# Altium schematic sheet recv_board.SchDoc
size A3; SheetNumber: 5; SheetTotal: 5
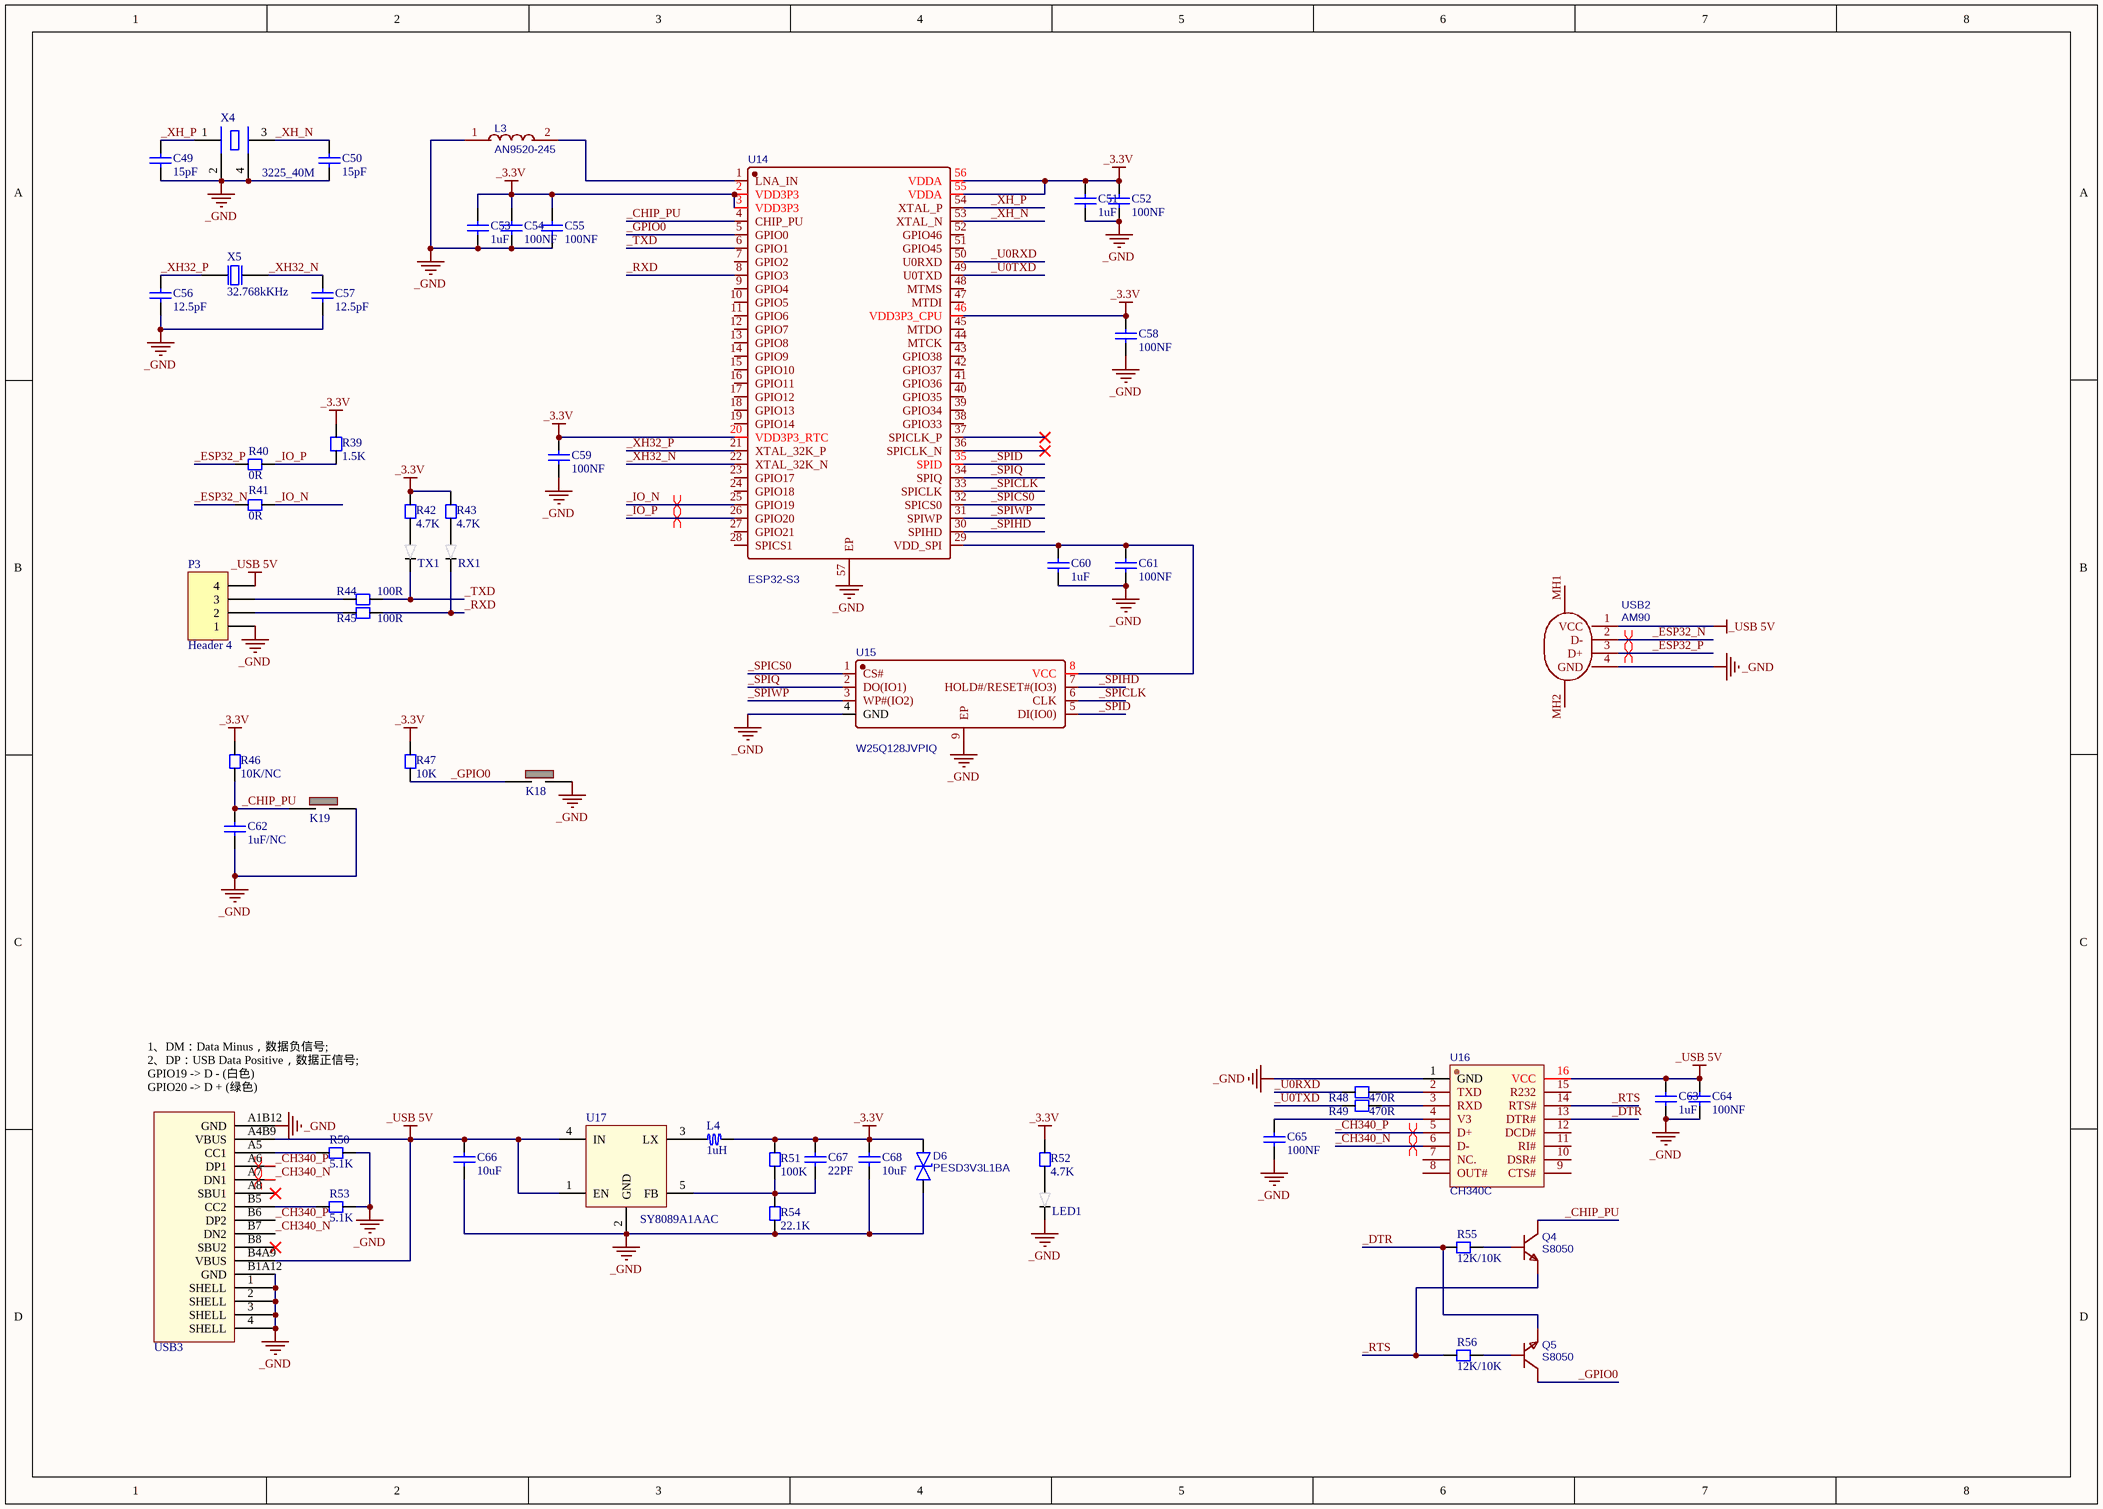
[diagram p0: recv_board.SchDoc]

## Parts
C49  15pF  [CC1608-0603]
C50  15pF  [CC1608-0603]
C51  1uF  [CC1608-0603]
C52  100NF  [CC1608-0603]
C53  1uF  [CC1608-0603]
C54  100NF  [CC1608-0603]
C55  100NF  [CC1608-0603]
C56  12.5pF  [CC1608-0603]
C57  12.5pF  [CC1608-0603]
C58  100NF  [CC1608-0603]
C59  100NF  [CC1608-0603]
C60  1uF  [CC1608-0603]
C61  100NF  [CC1608-0603]
C62  1uF/NC  [CC1608-0603]
C63  1uF  [CC1608-0603]
C64  100NF  [CC1608-0603]
C65  100NF  [CC1608-0603]
C66  10uF  [CC1608-0603]
C67  22PF  [CC1608-0603]
C68  10uF  [CC1608-0603]
D6  PESD3V3L1BA  [SOD-323]
K18  KEY 3*4  [KEY 3*4]  (value not drawn)
K19  KEY 3*4  [KEY 3*4]  (value not drawn)
L3  AN9520-245  [ANT-SMD_L9.5-W2.1]
L4  1uH  [Inductor-4018]
LED1  LED 0603  [LED 0603]  (value not drawn)
P3  Header 4  [HDR1X4]
Q4  S8050  [SOT-23]
Q5  S8050  [SOT-23]
R39  1.5K  [CR1608-0603]
R40  0R  [CR1608-0603]
R41  0R  [CR1608-0603]
R42  4.7K  [CR1608-0603]
R43  4.7K  [CR1608-0603]
R44  100R  [CR1608-0603]
R45  100R  [CR1608-0603]
R46  10K/NC  [CR1608-0603]
R47  10K  [CR1608-0603]
R48  470R  [CR1608-0603]
R49  470R  [CR1608-0603]
R50  5.1K  [CR1608-0603]
R51  100K  [CR1608-0603]
R52  4.7K  [CR1608-0603]
R53  5.1K  [CR1608-0603]
R54  22.1K  [CR1608-0603]
R55  12K/10K  [CR1608-0603]
R56  12K/10K  [CR1608-0603]
RX1  LED 0603  [LED 0603]  (value not drawn)
TX1  LED 0603  [LED 0603]  (value not drawn)
U14  ESP32-S3  [QFN-56]
U15  W25Q128JVPIQ  [WSON-8]
U16  CH340C  [SOP-16]
U17  SY8089A1AAC  [SOT23-5]
USB2  AM90  [USB-AM]
USB3  Tpye-c 16P  [TYPE-C 16P]  (value not drawn)
X4  3225_40M  [XTAL-3225]
X5  32.768kKHz  [XTAL-3215]

## Nets
_3.3V: C51.2 C52.2 C53.2 C54.2 C55.2 C58.2 C59.2 C67.2 C68.2 D6.1 L4.2 R39.1 R42.1 R43.1 R46.2 R47.2 R51.1 R52.1 U14.2(VDD3P3) U14.3(VDD3P3) U14.20(VDD3P3_RTC) U14.46(VDD3P3_CPU) U14.55(VDDA) U14.56(VDDA)
_GND: C49.1 C50.1 C51.1 C52.1 C53.1 C54.1 C55.1 C56.1 C57.1 C58.1 C59.1 C60.1 C61.1 C62.1 C63.1 C64.1 C65.1 C66.1 C68.1 D6.2 K18.2 K19.2 L3.1 LED1.2 P3.1 R50.1 R53.1 R54.2 U14.57(EP) U15.4(GND) U15.9(EP) U16.1(GND) U17.2(GND) USB2.4(GND) USB3.1(SHELL) USB3.2(SHELL) USB3.3(SHELL) USB3.4(SHELL) USB3.A1B12(GND) USB3.B1A12(GND) X4.2(GND) X4.4(GND)
_USB 5V: C63.2 C64.2 C66.2 P3.4 U16.16(VCC) U17.1(EN) U17.4(IN) USB2.1(VCC) USB3.A4B9(VBUS) USB3.B4A9(VBUS)
_CH340_N: U16.6(D-) USB3.A7(DN1) USB3.B7(DN2)
_CH340_P: U16.5(D+) USB3.A6(DP1) USB3.B6(DP2)
_CHIP_PU: C62.2 K19.1 Q4.3(C) R46.1 U14.4(CHIP_PU)
_DTR: Q5.2(E) R55.1 U16.13(DTR#)
_ESP32_N: R41.2 USB2.2(D-)
_ESP32_P: R40.2 USB2.3(D+)
_GPIO0: K18.1 Q5.3(C) R47.1 U14.5(GPIO0)
_IO_N: R41.1 U14.25(GPIO19)
_IO_P: R39.2 R40.1 U14.26(GPIO20)
_RTS: Q4.2(E) R56.1 U16.14(RTS#)
_RXD: R45.1 RX1.2 U14.8(GPIO3)
_SPICLK: U14.33(SPICLK) U15.6(CLK)
_SPICS0: U14.32(SPICS0) U15.1(CS#)
_SPID: U14.35(SPID) U15.5(DI(IO0))
_SPIHD: U14.30(SPIHD) U15.7(HOLD#/RESET#(IO3))
_SPIQ: U14.34(SPIQ) U15.2(DO(IO1))
_SPIWP: U14.31(SPIWP) U15.3(WP#(IO2))
_TXD: R44.1 TX1.2 U14.6(GPIO1)
_U0RXD: R48.2 U14.50(U0RXD)
_U0TXD: R49.2 U14.49(U0TXD)
_XH32_N: C57.2 U14.22(XTAL_32K_N) X5.2(OSC2)
_XH32_P: C56.2 U14.21(XTAL_32K_P) X5.1(OSC1)
_XH_N: C50.2 U14.53(XTAL_N) X4.3(OSC2)
_XH_P: C49.2 U14.54(XTAL_P) X4.1(OSC1)
NetC60_2: C60.2 C61.2 U14.29(VDD_SPI) U15.8(VCC)
NetC65_2: C65.2 U16.4(V3)
NetC67_1: C67.1 R51.2 R54.1 U17.5(FB)
NetL3_2: L3.2 U14.1(LNA_IN)
NetL4_1: L4.1 U17.3(LX)
NetLED1_1: LED1.1 R52.2
NetP3_2: P3.2 R45.2
NetP3_3: P3.3 R44.2
NetQ4_1: Q4.1(B) R55.2
NetQ5_1: Q5.1(B) R56.2
NetR42_2: R42.2 TX1.1
NetR43_2: R43.2 RX1.1
NetR48_1: R48.1 U16.2(TXD)
NetR49_1: R49.1 U16.3(RXD)
NetR50_2: R50.2 USB3.A5(CC1)
NetR53_2: R53.2 USB3.B5(CC2)

Not connected (* = marked no-connect by the designer): U14 7(GPIO2) 9(GPIO4) 10(GPIO5) 11(GPIO6) 12(GPIO7) 13(GPIO8) 14(GPIO9) 15(GPIO10) 16(GPIO11) 17(GPIO12) 18(GPIO13) 19(GPIO14) 23(GPIO17) 24(GPIO18) 27(GPIO21) 28(SPICS1) 36(SPICLK_N)* 37(SPICLK_P)* 38(GPIO33) 39(GPIO34) 40(GPIO35) 41(GPIO36) 42(GPIO37) 43(GPIO38) 44(MTCK) 45(MTDO) 47(MTDI) 48(MTMS) 51(GPIO45) 52(GPIO46); U16 7(NC.) 8(OUT#) 9(CTS#) 10(DSR#) 11(RI#) 12(DCD#) 15(R232); USB2 MH1 MH2; USB3 A8(SBU1)* B8(SBU2)*

## Layout directives
differential pair: _CH340_N, _CH340_P, _ESP32_N, _ESP32_P, _IO_N, _IO_P

## Notes on the sheet
- (near USB3) 1、DM：Data Minus，数据负信号;
  2、DP：USB Data Positive，数据正信号;
  GPIO19 -> D - (白色)
  GPIO20 -> D + (绿色)

## Library data of the parts
C49-C68 = Cap Chip 0603: 0603封装的电容; Published: 8-Jun-2000; Revision: July-2002: Re-released for DXP Platform.; Publisher: Altium Limited
D6 = PESD3V3L1BA: SOD-323 3.3V 双向ESD防静电二极管保护芯片; Manufacturer: MDD; Manufacturer Part: SMAJ6.5CA; Supplier: LCSC; Supplier Part: C110041; JLCPCB Part Class: Extended Part; spicePre: D; spiceSymbolName: SMAJ6.5CA-C110041
K18 K19 = KEY 3*4: 轻触开关按键
L3 = AN9520-245: Manufacturer: rainsun(霖昱微); Supplier: LCSC; Manufacturer Part: AN9520-245; Supplier Part: C99665; JLCPCB Part Class: Extended Part; spicePre: L; spiceSymbolName: AN9520-245
L4 = Inductor-4018: 贴片电感 1206封装
P3 = Header 4: Header, 4-Pin; LatestRevisionDate: 17-Jul-2002; LatestRevisionNote: Re-released for DXP Platform.; Publisher: Altium Limited
Q4 Q5 = S8050: Manufacturer: SALLTECH(萨瑞); Contributor: lcsc; Supplier: LCSC; Supplier Part: C3027096; Manufacturer Part: S8050; spicePre: Q; spiceSymbolName: S8050_C3027096
R39-R56 = Resistor Chip 0603: 0603封装电阻; Published: 8-Jun-2000; Revision: July-2002: Re-released for DXP Platform.; Publisher: Altium Limited
U14 = ESP32-S3: Manufacturer: ESPRESSIF(乐鑫); Contributor: LCSC; Supplier: LCSC; Supplier Part: C2913192; Manufacturer Part: ESP32-S3; JLCPCB Part Class: Extended Part; spicePre: U; spiceSymbolName: ESP32-S3
U15 = W25Q128JVPIQ: Manufacturer: WINBOND(华邦); Contributor: LCSC; Supplier: LCSC; Supplier Part: C2803379; Manufacturer Part: W25Q128JVPIQ; JLCPCB Part Class: Extended Part; spicePre: U; spiceSymbolName: W25Q128JVPIQ
U16 = CH340C: Manufacturer: WCH(南京沁恒); Supplier: LCSC; Manufacturer Part: CH340C; Supplier Part: C84681; JLCPCB Part Class: Extended Part; spicePre: U; spiceSymbolName: CH340C
U17 = SY8089A1AAC: SY8089A1是一种高效率的1.5MHz同步降压DC/DC稳压器，能够提供高达输出电流2A。它可以在2.5V到5.5V的宽输入电压范围内工作，集成了主开关和同步开关，具有极低的RDS(ON)，最大限度地减少了导通损耗。 / 输出电压纹波小，外接电感小，电容器尺寸小 / 1.5MHz开关频率。
USB2 = USB-AM90: Manufacturer: SHOU HAN(首韩); Contributor: LCSC; Supplier: LCSC; Supplier Part: C404965; Manufacturer Part: AM90; JLCPCB Part Class: Extended Part; spicePre: U; spiceSymbolName: AM90
USB3 = Tpye-c 16P: 16P 封装的TYPE -c接口 4固定插脚 双向
X4 = XTAL 3225: 3225封装的晶振
X5 = XTAL 3215 32.768kKHz: 3215封装的时钟晶振